# Altium schematic sheet Main_PCB.SchDoc: Main_PCB
size A4; Organization: Institut d'Automatisation Industrielle; SheetNumber: 1; SheetTotal: 8; SVN: OUI; CurrentTime: 6; CurrentDate: 5; DocumentFullPathAndName: 8; DocumentName: 9; ModifiedDate: 13; ProjectName: <projet>
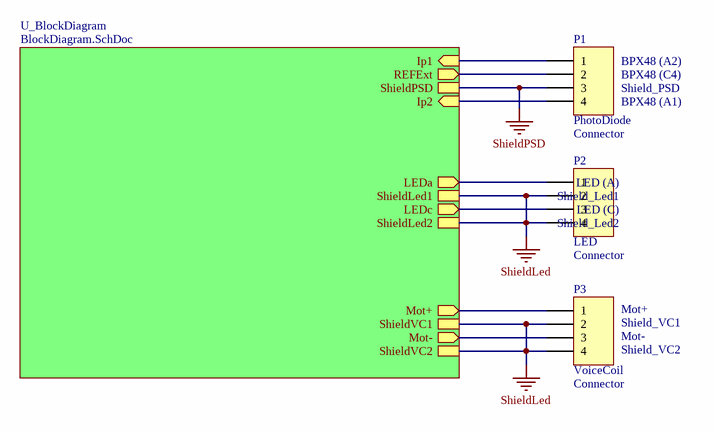
[diagram p0: Main_PCB.SchDoc]

## Parts
P1  PhotoDiode  System: Connector  [HDR1X4]
P2  LED  System: Connector  [HDR1X4]
P3  VoiceCoil  System: Connector  [HDR1X4]

## Sub-sheets
U_BlockDiagram = BlockDiagram.SchDoc: Ip1 (in), REFExt (out), LEDa (out), LEDc (out), Mot+ (out), Mot- (out), ShieldPSD, Ip2 (in), ShieldLed1, ShieldLed2, ShieldVC1, ShieldVC2

## Nets
ShieldLed: P2.2 P2.4 P3.2 P3.4 ; sheet U_BlockDiagram/ShieldLed1, sheet U_BlockDiagram/ShieldLed2, sheet U_BlockDiagram/ShieldVC1, sheet U_BlockDiagram/ShieldVC2
ShieldPSD: P1.3 ; sheet U_BlockDiagram/ShieldPSD
NetP1_1: P1.1 ; sheet U_BlockDiagram/Ip1
NetP1_2: P1.2 ; sheet U_BlockDiagram/REFExt
NetP1_4: P1.4 ; sheet U_BlockDiagram/Ip2
NetP2_1: P2.1 ; sheet U_BlockDiagram/LEDa
NetP2_3: P2.3 ; sheet U_BlockDiagram/LEDc
NetP3_1: P3.1 ; sheet U_BlockDiagram/Mot+
NetP3_3: P3.3 ; sheet U_BlockDiagram/Mot-

## Notes on the sheet
- (near P1) BPX48 (A2)
- (near P1) BPX48 (C4)
- (near P1) Shield_PSD
- (near P1) BPX48 (A1)
- (near P2) LED (C)
- (near P2) Shield_Led1
- (near P2) LED (A)
- (near P2) Shield_Led2
- (near P3) Mot+
- (near P3) Mot-
- (near P3) Shield_VC1
- (near P3) Shield_VC2
- Title
- Institut d'automatisation industrielle
  rte de Cheseaux 1
  CH-1401 Yverdon-les-Bains
  T +41(0)24 55 77 377    F +41(0)24 55 76 320
  http://iai.heig-vd.ch       iai@heig-vd.ch
- Date:
- Size:
- A4
- Project:
- Sheet
- of
- No.
- Author:
- SVN
- Version
- File:

## Library data of the parts
P1-P3 = Header 4: LatestRevisionDate: 17-Jul-2002; LatestRevisionNote: Re-released for DXP Platform.; Publisher: Altium Limited